# Altium schematic sheet Sheet1.SchDoc
size A4; SheetNumber: 1; SheetTotal: 1
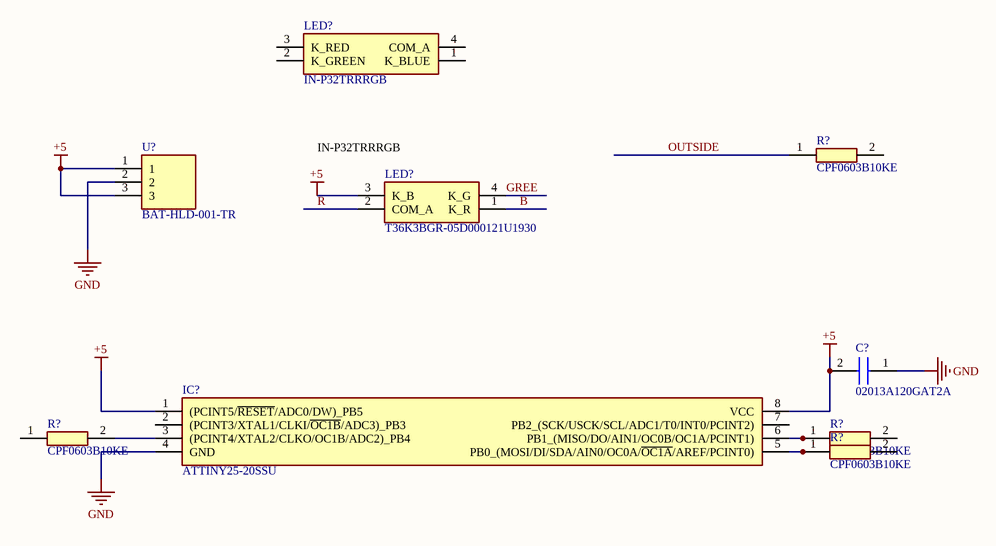
[diagram p0: Sheet1.SchDoc]

## Parts
(Parts that share a designator on the sheet are numbered #1, #2 ... from top to bottom, then left to right.)
C?  02013A120GAT2A  [CAPC0603X33N]
IC?  ATTINY25-20SSU  [SOIC127P600X175-8N]
LED?#1  IN-P32TRRRGB  [INP32TRRRGB]
LED?#2  T36K3BGR-05D000121U1930  [T36K3BGR05D000121U1930]
R?#1  CPF0603B10KE  [RESC1608X55N]
R?#2  CPF0603B10KE  [RESC1608X55N]
R?#3  CPF0603B10KE  [RESC1608X55N]
R?#4  CPF0603B10KE  [RESC1608X55N]
U?  BAT-HLD-001-TR  [BATHLD001TR]

## Nets
+5: C?.2 IC?.1((PCINT5/~{RESET}/ADC0/DW)_PB5) IC?.8(VCC) LED?#2.3(K_B) U?.1 U?.3
GND: C?.1 IC?.4(GND) U?.2
B: LED?#2.1(K_R)
GREE: LED?#2.4(K_G)
OUTSIDE: R?#1.1
R: LED?#2.2(COM_A)
NetIC?_3: IC?.3((PCINT4/XTAL2/CLKO/OC1B/ADC2)_PB4) R?#2.2
NetIC?_5: IC?.5(PB0_(MOSI/DI/SDA/AIN0/OC0A/~{OC1A}/AREF/PCINT0)) R?#4.1
NetIC?_6: IC?.6(PB1_(MISO/DO/AIN1/OC0B/OC1A/PCINT1)) R?#3.1

Not connected (* = marked no-connect by the designer): IC? 2((PCINT3/XTAL1/CLKI/~{OC1B}/ADC3)_PB3) 7(PB2_(SCK/USCK/SCL/ADC1/T0/INT0/PCINT2)); LED?#1 1(K_BLUE) 2(K_GREEN) 3(K_RED) 4(COM_A); R?#1 2; R?#2 1; R?#3 2; R?#4 2

## Notes on the sheet
- (near LED?#2) IN-P32TRRRGB

## Library data of the parts
C? = 02013A120GAT2A: Capacitor; Manufacturer_Name: AVX; Datasheet Link: http://www.mouser.com/catalog/supplier/library/pdf/AVXSurfaceMountCeramic.pdf; Height: 0.33mm; Manufacturer_Part_Number: 02013A120GAT2A; Mouser Part Number: 581-02013A120GAT2A; Mouser Price/Stock: https://www.mouser.com/Search/Refine.aspx?Keyword=581-02013A120GAT2A; Arrow Part Number: 02013A120GAT2A; Arrow Price/Stock: https://www.arrow.com/en/products/02013a120gat2a/avx
IC? = ATTINY25-20SSU: Integrated Circuit; Manufacturer_Name: Microchip; Datasheet Link: http://www.atmel.com/Images/Atmel-2586-AVR-8-bit-Microcontroller-ATtiny25-ATtiny45-ATtiny85_Datasheet.pdf; Height: 1.75mm; Manufacturer_Part_Number: ATTINY25-20SSU; Mouser Part Number: 556-ATTINY25-20SSU; Mouser Price/Stock: https://www.mouser.co.uk/ProductDetail/Microchip-Technology/ATTINY25-20SSU?qs=W7X4MxMep4%2FZkAO8oc8Rxw%3D%3D; Arrow Part Number: ATTINY25-20SSU; Arrow Price/Stock: https://www.arrow.com/en/products/attiny25-20ssu/microchip-technology?region=nac
LED?#1 = IN-P32TRRRGB: LED; Manufacturer_Name: Inolux; Datasheet Link: http://www.inolux-corp.com/datasheet/SMDLED/Mono%20Color%20Reverse%20Mount/IN-P32TRRRGB_V1.2.pdf; Height: 1.17mm; Manufacturer_Part_Number: IN-P32TRRRGB; Mouser Part Number: 743-IN-P32TRRRGB; Mouser Price/Stock: https://www.mouser.co.uk/ProductDetail/Inolux/IN-P32TRRRGB?qs=stqOd1AaK7%252BDecAY%252B9SBpg%3D%3D; Arrow Part Number: IN-P32TRRRGB; Arrow Price/Stock: https://www.arrow.com/en/products/in-p32trrrgb/inolux-corporation?region=nac
LED?#2 = T36K3BGR-05D000121U1930: LED; Manufacturer_Name: Harvatek; Datasheet Link: https://media.digikey.com/pdf/Data%20Sheets/Harvatek%20PDFs/T36K3BGR-05D000121U1930%20V1.1.pdf; Height: 1.95mm; Manufacturer_Part_Number: T36K3BGR-05D000121U1930
R?#1-R?#4 = CPF0603B10KE: Resistor; Manufacturer_Name: TE Connectivity; Datasheet Link: http://www.farnell.com/datasheets/1786775.pdf; Height: 0.55mm; Manufacturer_Part_Number: CPF0603B10KE; Mouser Part Number: 279-CPF0603B10KE; Mouser Price/Stock: https://www.mouser.co.uk/ProductDetail/TE-Connectivity-Holsworthy/CPF0603B10KE?qs=DfH2yQaBz6sBU3bWyKu9NQ%3D%3D; Arrow Part Number: CPF0603B10KE; Arrow Price/Stock: https://www.arrow.com/en/products/cpf0603b10ke/te-connectivity?region=nac
U? = BAT-HLD-001-TR: Undefined or Miscellaneous; Manufacturer_Name: Linx Technologies; Datasheet Link: https://datasheet.datasheetarchive.com/originals/distributors/DKDS-31/603271.pdf; Height: 4.2mm; Manufacturer_Part_Number: BAT-HLD-001-TR; Mouser Part Number: 712-BAT-HLD-001-TR; Mouser Price/Stock: https://www.mouser.co.uk/ProductDetail/Linx-Technologies/BAT-HLD-001-TR?qs=K5ta8V%252BWhtZh3MyWmkkmjQ%3D%3D